# EAGLE design Power_ab (EAGLE 7.3.0)
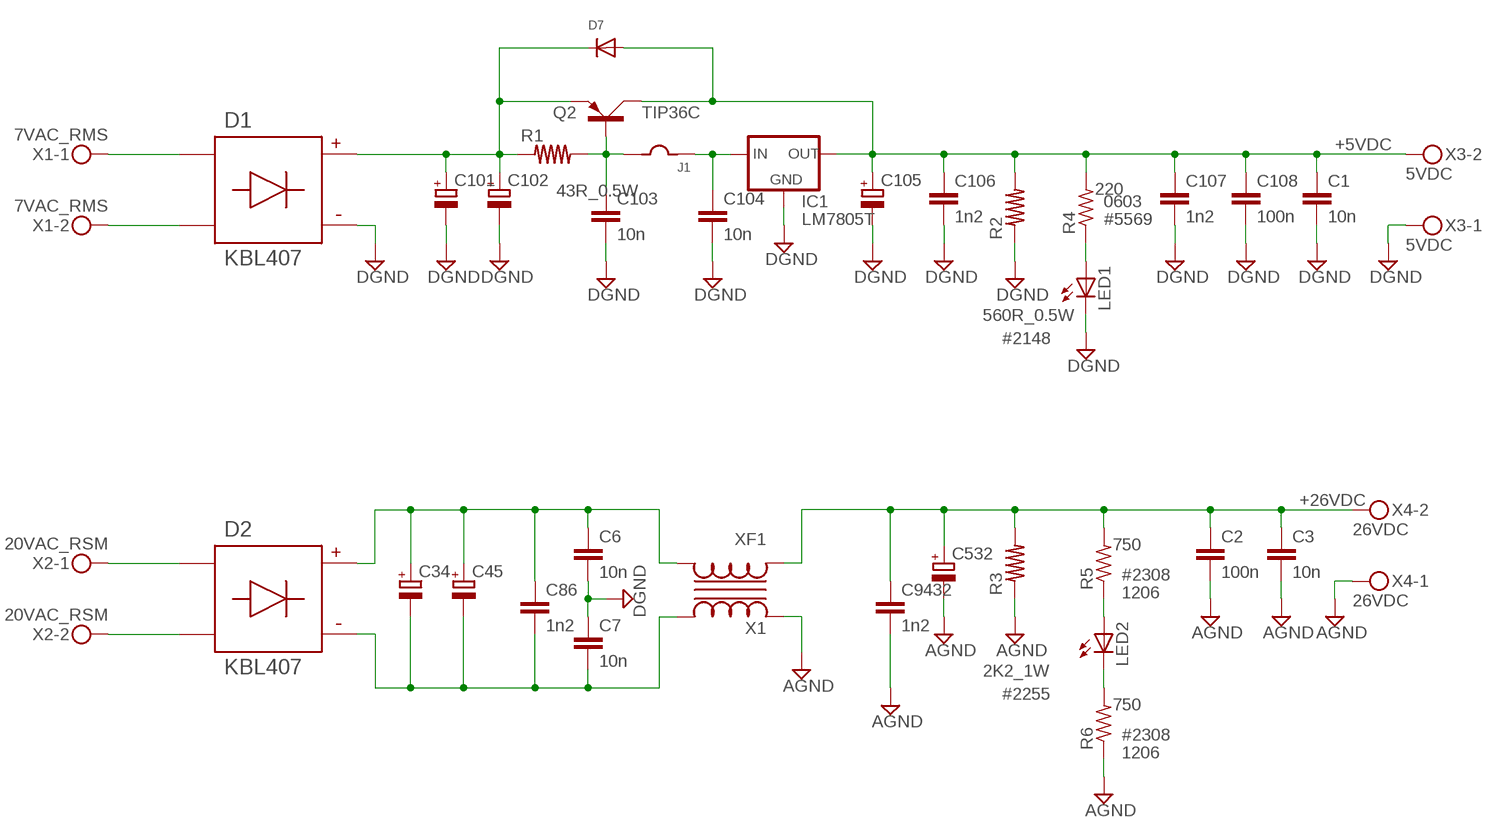
[diagram p0: schematic, sheet 1]

## Parts
C1  10n  C-EUC1206  [C1206]
C2  100n  C-EUC1206  [C1206]
C3  10n  C-EUC1206  [C1206]
C6  10n  C-EUC1206  [C1206]
C7  10n  C-EUC1206  [C1206]
C34  CPOL-EUEB20C  [EB20C]
C45  CPOL-EUEB20C  [EB20C]
C86  1n2  C-EU075-032X103  [C075-032X103]
C101  CPOL-EUE7.5-18  [E7,5-18]
C102  CPOL-EUE7.5-18  [E7,5-18]
C103  10n  C-EUC1206  [C1206]
C104  10n  C-EUC1206  [C1206]
C105  CPOL-EUE7.5-18  [E7,5-18]
C106  1n2  C-EU075-032X103  [C075-032X103]
C107  1n2  C-EU075-032X103  [C075-032X103]
C108  100n  C-EUC1206  [C1206]
C532  CPOL-EUEB20C  [EB20C]
C9432  1n2  C-EU075-032X103  [C075-032X103]
D1  KBL407  [KBL]
D2  KBL407  [KBL]
D7  1N4007  [DO-41]
IC1  LM7805T  78XXS  [78XXS]
J1  JUMP350MILS  [JUMP350]
LED1  LED5MM  [LED5MM]
LED2  LED5MM  [LED5MM]
Q2  TIP36C  TIP2955  [TOP3AV]
R1  43R_0.5W  R0W50500MILS  [50R500]
R2  560R_0.5W  R0W50500MILS  [50R500]
R3  2K2_1W  R0W50500MILS  [50R500]
R4  220  R-US_R0603  [R0603]
R5  750  R-US_R1206  [R1206]
R6  750  R-US_R1206  [R1206]
X1  7VAC_RMS  MKDSN1,5/2-5,08  [MKDSN1,5/2-5,08]
X2  20VAC_RSM  MKDSN1,5/2-5,08  [MKDSN1,5/2-5,08]
X3  5VDC  MKDSN1,5/2-5,08  [MKDSN1,5/2-5,08]
X4  26VDC  MKDSN1,5/2-5,08  [MKDSN1,5/2-5,08]
XF1  X1  TRF_LINETRF_LINE  [TORO1]

## Nets
+5VDC: C1.1 C105.+ C106.1 C107.1 C108.1 D7.A(ANODE) IC1.OUT Q2.C R2.P$2 R4.2 X3.2
+26VDC: C2.1 C3.1 C532.+ C9432.1 R3.P$2 R5.2 X4.2 XF1.L1A
AGND: C2.2 C3.2 C532.- C9432.2 R3.P$1 R6.1 X4.1 XF1.L2A
DGND: C1.2 C6.2 C7.1 C101.- C102.- C103.2 C104.2 C105.- C106.2 C107.2 C108.2 D1.- IC1.GND LED1.K(C) R2.P$1 X3.1
N$1: C101.+ C102.+ D1.+ D7.K(KATODE) Q2.E R1.P$1
N$2: D1.AC1 X1.1
N$3: D1.AC2 X1.2
N$4: D2.AC1 X2.1
N$5: D2.AC2 X2.2
N$6: C104.1 IC1.IN J1.P$2
N$7: C6.1 C34.+ C45.+ C86.1 D2.+ XF1.L1B
N$9: C103.1 J1.P$1 Q2.B R1.P$2
N$12: C7.2 C34.- C45.- C86.2 D2.- XF1.L2B
N$14: LED1.A R4.1
N$15: LED2.A R5.1
N$16: LED2.K(C) R6.2

## Library data of the parts
C1-C3 C6 C7 C103 C104 C108 = rcl:C-EU: CAPACITOR, European symbol; ALMACEN: #375
C34 C45 C101 C102 C105 C532 = rcl:CPOL-EU: POLARIZED CAPACITOR, European symbol
C86 C106 C107 C9432 = rcl:C-EU: CAPACITOR, European symbol; ALMACEN: #3722
D1 D2 = ABS:KBL407
D7 = ABS:1N4007
IC1 = v-reg:78XXS: VOLTAGE REGULATOR
J1 = adbm2015:JUMP: Jumper Grid => 10
LED1 LED2 = led:LED: LED OSRAM: - CHIPLED LG R971, LG N971, LY N971, LG Q971, LY Q971, LO R971, LY R971 LH N974, LH R974 LS Q976, LO Q976, LY Q976 LO Q996 - Hyper CHIPLED LW Q18S LB Q993, LB Q99A, LB R99A - SideLED LS A670, LO A670, LY A670, LG A670, LP A670 LB A673, LV A673, LT A673, LW A673 LH A674 LY A675 LS A676, LA A676, LO A676, LY A676, LW A676 LS A679, LY A679, LG A679 - Hyper Micro SIDELED® LS Y876, LA Y876, LO Y876, LY Y876 LT Y87S - SmartLED LW L88C, LW L88S LB L89C, LB L89S, LG L890 LS L89K, LO L89K, LY L89K LS L896, LA L896, LO L896, LY L896 - TOPLED LS T670, LO T670, LY T670, LG T670, LP T670 LSG T670, LSP T670, LSY T670, LOP T670, LYG T670 LG T671, LOG T671, LSG T671 LB T673, LV T673, LT T673, LW T673 LH T674 LS T676, LA T676, LO T676, LY T676, LB T676, LH T676, LSB T676, LW T676 LB T67C, LV T67C, LT T67C, LS T67K, LO T67K, LY T67K, LW E67C LS E67B, LA E67B, LO E67B, LY E67B, LB E67C, LV E67C, LT E67C LW T67C LS T679, LY T679, LG T679 LS T770, LO T770, LY T770, LG T770, LP T770 LB T773, LV T773, LT T773, LW T773 LH T774 LS E675, LA E675, LY E675, LS T675 LS T776, LA T776, LO T776, LY T776, LB T776 LHGB T686 LT T68C, LB T68C - Hyper Mini TOPLED® LB M676 - Mini TOPLED Santana® LG M470 LS M47K, LO M47K, LY M47K Source: http://www.osram.convergy.de LUXEON: - LUMILED® LXK2-PW12-R00, LXK2-PW12-S00, LXK2-PW14-U00, LXK2-PW14-V00 LXK2-PM12-R00, LXK2-PM12-S00, LXK2-PM14-U00 LXK2-PE12-Q00, LXK2-PE12-R00, LXK2-PE12-S00, LXK2-PE14-T00, LXK2-PE14-U00 LXK2-PB12-K00, LXK2-PB12-L00, LXK2-PB12-M00, LXK2-PB14-N00, LXK2-PB14-P00, LXK2-PB14-Q00 LXK2-PR12-L00, LXK2-PR12-M00, LXK2-PR14-Q00, LXK2-PR14-R00 LXK2-PD12-Q00, LXK2-PD12-R00, LXK2-PD12-S00 LXK2-PH12-R00, LXK2-PH12-S00 LXK2-PL12-P00, LXK2-PL12-Q00, LXK2-PL12-R00 Source: www.luxeon.com KINGBRIGHT: KA-3528ASYC Source: www.kingbright.com
Q2 = transistor-power:TIP2955: PNP TRANSISTOR
R1 = adbm2013:R0W50: RESISTENCIA AXIAL P = 1/2W GRIDs => 500 mils 600 mils 750 mils
R2 = adbm2013:R0W50: RESISTENCIA AXIAL P = 1/2W GRIDs => 500 mils 600 mils 750 mils; ALMACEN: #2148
R3 = adbm2013:R0W50: RESISTENCIA AXIAL P = 1/2W GRIDs => 500 mils 600 mils 750 mils; ALMACEN: #2255
R4 = rcl:R-US_: RESISTOR, American symbol; ALMACEN: #5569; PACKAGE: 0603
R5 R6 = rcl:R-US_: RESISTOR, American symbol; ALMACEN: #2308; PACKAGE: 1206
X1-X4 = con-phoenix-508:MKDSN1,5/2-5,08: MKDSN 1,5/ 2-5,08 Printklemme Nennstrom: 13,5 A Nennspannung: 250 V Rastermaß: 5,08 mm Polzahl: 2 Anschlussart: Schraubanschluss Montage: Löten Anschlussrichtung Leiter/Platine: 0 ° Artikelnummer: 1729128 Source: http://eshop.phoenixcontact.com .. 1729128.pdf
XF1 = adbm2015:TRF_LINE

## Board
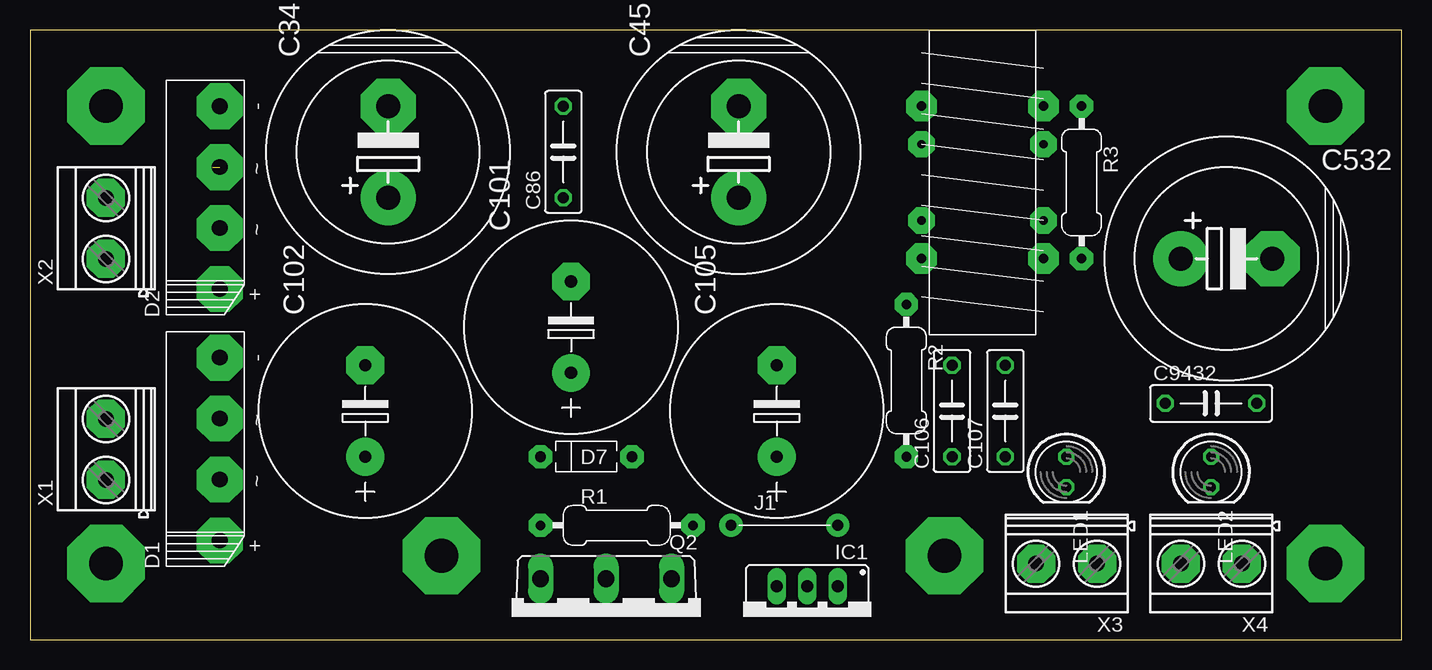
[diagram p1: board, top side]
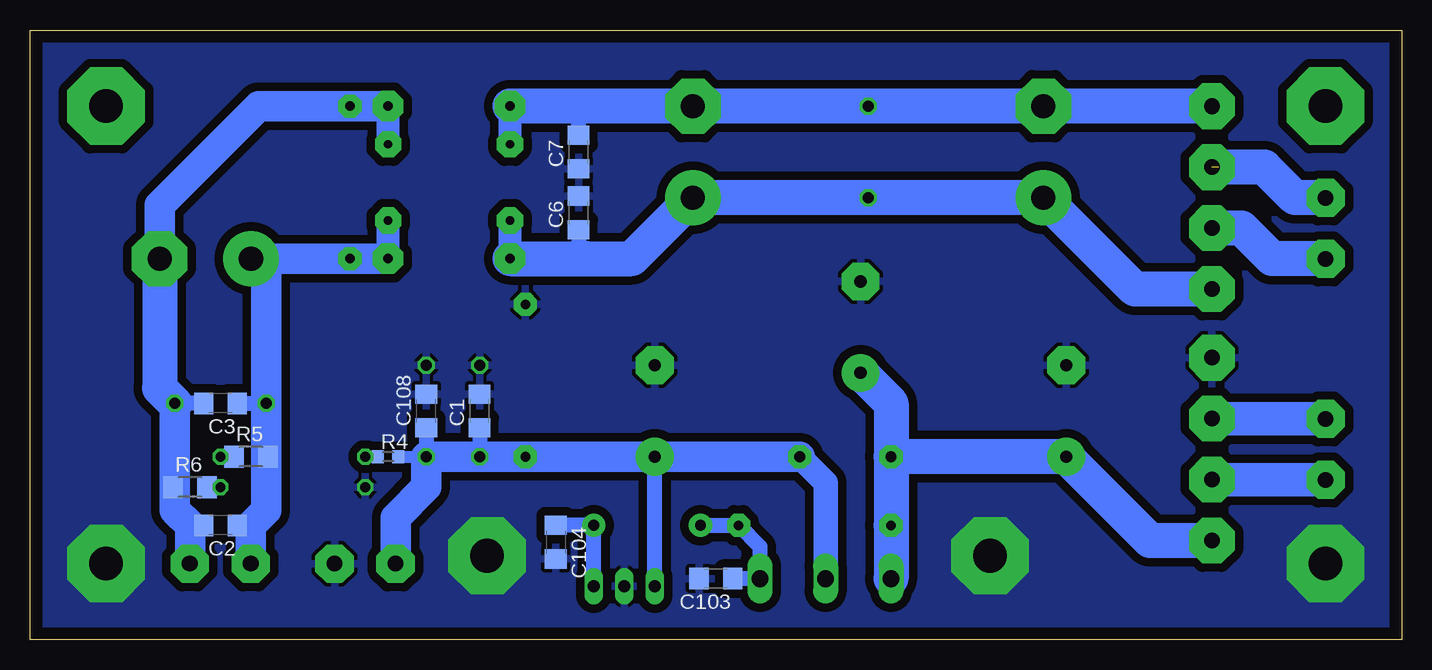
[diagram p2: board, bottom side, seen from below]

Size 114.3 x 50.8 mm. Coordinates in mm from the lower left corner, seen from the top.
Outline: 114.3,50.8 0,50.8 0,0 114.3,0 114.3,50.8
Copper layers (1*16): Top 0.035mm / dielectric 1.5mm / Bottom 0.035mm
Design rules "default *": minimum track width 10mil, minimum drill 24mil, track to track 8mil, track to pad 8mil, pad to pad 8mil, via to via 8mil, smd to smd 8mil, copper to edge 40mil, drill to drill 8mil, minimum pad ring 10mil, minimum via ring 8mil, stop-mask expansion 4mil, vias tented up to drill 0mil, thermal gap 12mil

### Footprints (pad centres in the part's own frame; a part is rotated, then mirrored left to right if it is on the bottom)
C1206 = smd 1.6 x 1.8: 1 -1.4,0; 2 1.4,0
EB20C = drill 2.007 pad 4.597: + -3.81,0 | drill 2.007 pad 4.597 octagon: - 3.81,0
C075-032X103 = drill 0.914 octagon: 1 -3.81,0; 2 3.81,0
E7,5-18 = drill 1.016 pad 3.15: + -3.81,0 | drill 1.016 pad 3.15 octagon: - 3.81,0
KBL = drill 1.3 pad 3.81 octagon: + -7.62,-1.206; - 7.62,-1.206; AC1 -2.54,-1.206; AC2 2.54,-1.206
DO-41 = drill 0.9 pad 1.93 octagon: A -3.81,0; K 3.81,0
78XXS = drill 1.016 long: GND 0,-2.54; IN -2.54,-2.54; OUT 2.54,-2.54
JUMP350 = drill 0.9 pad 1.93: P$1 -4.445,0; P$2 4.445,0
LED5MM = drill 0.813 octagon: A -1.27,0; K 1.27,0
TOP3AV = drill 1.397 long: B -5.461,-3.175; C 0,-3.175; E 5.461,-3.175
50R500 = drill 0.8 pad 1.93 octagon: P$1 -6.35,0; P$2 6.35,0
R0603 = smd 1 x 1.1: 1 -0.85,0; 2 0.85,0
R1206 = smd 1.6 x 1.803: 1 -1.422,0; 2 1.422,0
MKDSN1,5/2-5,08 = drill 1.3 pad 3.175 octagon: 1 -2.561,0.025; 2 2.519,0.025
TORO1 = drill 0.8 pad 2.54 octagon: L1A -5.08,6.35; L1B 5.08,6.35; L2A -5.08,-6.35; L2B 5.08,-6.35

### Placement (x,y rotation side)
C1  76.83,19.05 90 bottom
C2  98.42,9.53 180 bottom
C3  98.42,19.68 180 bottom
C6  68.58,35.56 90 bottom
C7  68.58,40.64 90 bottom
C34  29.84,40.64 90 top
C45  59.05,40.64 90 top
C86  44.45,40.64 90 top
C101  45.09,26.04 90 top
C102  27.94,19.05 90 top
C103  57.15,5.08 180 bottom
C104  70.48,8.12 270 bottom
C105  62.23,19.05 90 top
C106  76.83,19.05 90 top
C107  81.28,19.05 90 top
C108  81.28,19.05 90 bottom
C532  99.69,31.75 0 top
C9432  98.42,19.68 0 top
D1  14.61,15.88 90 top
D2  14.61,36.83 90 top
D7  46.35,15.24 180 top
IC1  64.77,1.91 180 top
J1  62.87,9.53 0 top
LED1  86.36,13.97 270 top
LED2  98.42,13.97 270 top
Q2  48.01,1.91 180 top
R1  48.9,9.53 0 top
R2  73.03,21.59 270 top
R3  87.63,38.1 270 top
R4  84.45,15.24 0 bottom
R5  95.89,15.24 0 bottom
R6  100.97,12.7 0 bottom
X1  6.35,15.88 90 top
X2  6.35,34.29 90 top
X3  86.36,6.35 180 top
X4  98.42,6.35 180 top
XF1  79.38,38.1 180 top

### Tracks (layer width: path | path; a pad name or v marks a point on that pad's centre or on a via)
+5VDC
  Bottom 1.016: R4.2 C107.1
  Bottom 1.27: IC1.OUT C105.+ | C1.1 C106.1 | C108.1 C107.1
  Bottom 2.032: Q2.C 48.01,13.08 D7.A
  Bottom 2.54: D7.A C105.+ R2.P$2 C106.1 C107.1 81.28,12.72 83.84,10.16 X3.2
+26VDC  (via drill 0.7 pad 2.18)
  Bottom 0.813: R5.2 94.61,15.24
  Bottom 1.27: C3.1 C9432.1 | C2.1 97,9.5 95.91,9.5
  Bottom 1.93: XF1.L1A v84.45,34.92
  Bottom 2.54: XF1.L1A R3.P$2 94.61,31.75 | X4.2 95.91,9.5 94.61,10.79 94.61,15.24 C9432.1 94.61,31.75 | C532.+ 94.61,31.75
AGND  (via drill 0.7 pad 2.18)
  Bottom 0.813: R6.1 102.23,12.7
  Bottom 1.27: C3.2 C9432.2 | C2.2 100.97,9.53
  Bottom 1.93: v84.45,41.27 XF1.L2A
  Bottom 2.54: XF1.L2A R3.P$1 95.25,44.45 103.5,36.2 C532.- | X4.1 100.97,6.35 100.97,9.53 102.23,10.79 102.23,12.7 C9432.2
  Bottom 2.921: C532.- 103.5,20.95 C9432.2
DGND  (via drill 2.8 pad 6.45)
  other vias: 34.29,6.99 76.2,6.99 6.35,6.35 107.95,6.35
  pour Bottom (isolate 0.711): 121.92,-0.64 -0.64,-0.64 -0.64,53.34 121.92,53.34
N$1
  Bottom 2.921: D1.+ 20.95,8.26 C102.+ D7.K | C101.+ 42.55,19.68 D7.K | D7.K R1.P$1 Q2.E
N$2
  Bottom 2.794: X1.1 D1.AC1
N$3
  Bottom 2.794: X1.2 D1.AC2
N$4
  Bottom 2.921: X2.1 6.35,31.75 10.79,31.75 13.34,34.29 D2.AC1
N$5  (1 unrouted)
  Bottom 2.921: X2.2 6.35,36.83 8.89,36.83 11.43,39.37 15.24,39.37
N$6
  Bottom 1.27: IC1.IN J1.P$2 C104.1
N$7  (via drill 0.7 pad 2.18)
  Bottom 1.27: C6.1 68.58,31.75
  Bottom 1.778: 68.58,31.75 67.94,31.75
  Bottom 1.93: XF1.L1B v74.3,34.92
  Bottom 2.921: D2.+ 22.23,29.21 C34.+ C86.1 C45.+ 64.14,31.75 67.94,31.75 XF1.L1B
N$9
  Bottom 1.27: J1.P$1 R1.P$2 53.47,7.75 Q2.B C103.1
N$10  (via drill 2.8 pad 6.45)
  other vias: 6.35,44.45
N$11  (via drill 2.8 pad 6.45)
  other vias: 107.95,44.45
N$12  (via drill 0.7 pad 2.18)
  Bottom 1.27: C7.2 68.58,44.45
  Bottom 1.93: v74.3,41.27 XF1.L2B
  Bottom 2.921: D2.- C34.- C86.2 C45.- 68.58,44.45 XF1.L2B
N$14
  Bottom 0.813: R4.1 LED1.A
N$15
  Bottom 0.813: R5.1 LED2.A
N$16
  Bottom 0.813: R6.2 LED2.K